# EAGLE design Dclock4 (EAGLE 8.7.0)
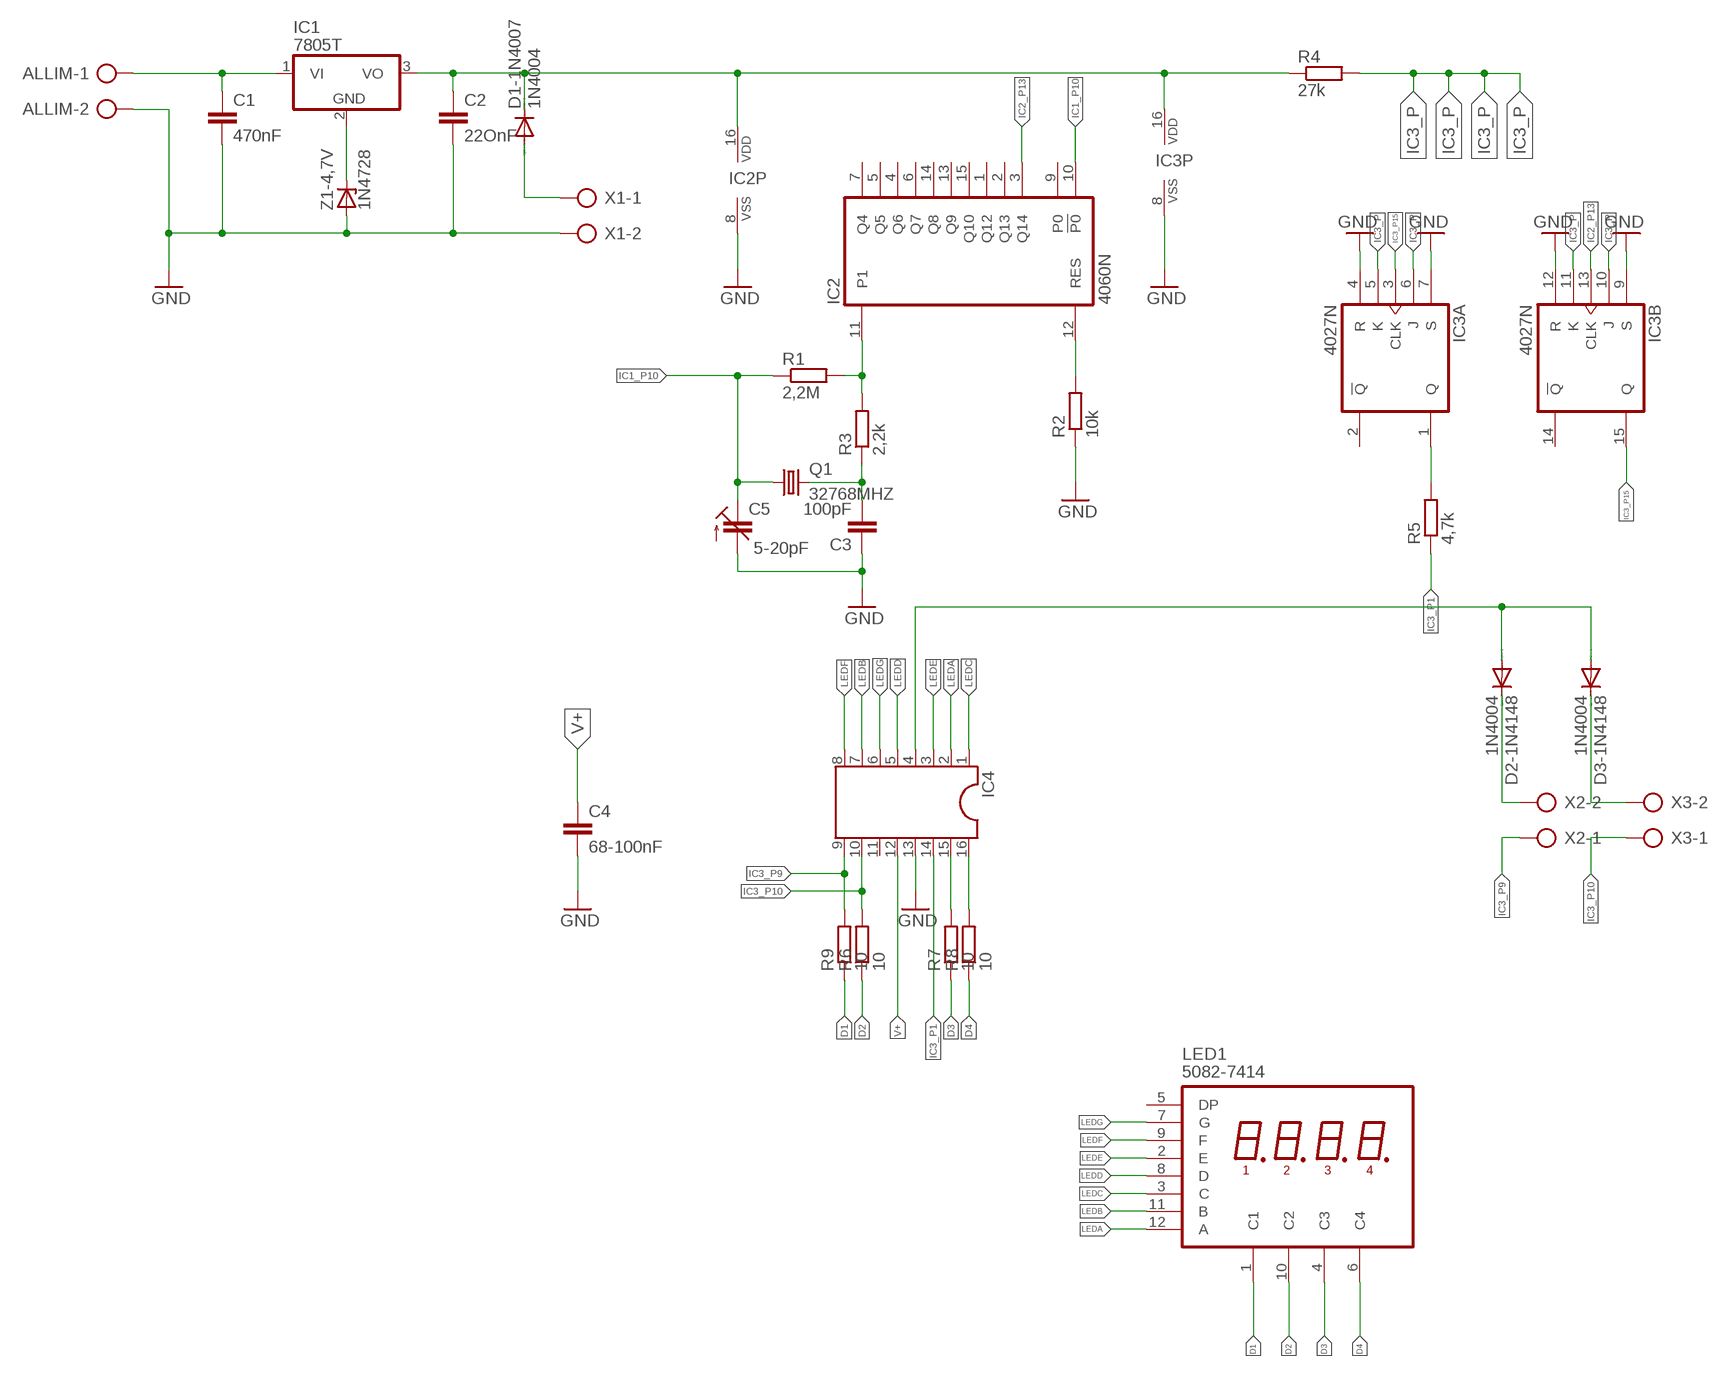
[diagram p0: schematic, sheet 1]

## Parts
ALLIM  AK300/2  [AK300/2]
C1  470nF  C-EU050-050X075  [C050-050X075]
C2  22OnF  C-EU050-050X075  [C050-050X075]
C3  100pF  C-EU050-050X075  [C050-050X075]
C4  68-100nF  C-EU050-050X075  [C050-050X075]
C5  5-20pF  C-TRIMM808-1  [CTRIM808-1]
D1-1N4007  1N4004  [DO41-10]
D2-1N4148  1N4004  [DO41-10]
D3-1N4148  1N4004  [DO41-10]
IC1  7805T  [TO220H]
IC2  4060N  [DIL16]
IC3  4027N  [DIL16]
IC4  DIL16  [DIL16]
LED1  5082-7414  [5082-7414]
Q1  32768MHZ  CRYSTALHC49S  [HC49/S]
R1  2,2M  R-EU_0204/7  [0204/7]
R2  10k  R-EU_0204/7  [0204/7]
R3  2,2k  R-EU_0204/7  [0204/7]
R4  27k  R-EU_0204/7  [0204/7]
R5  4,7k  R-EU_0204/7  [0204/7]
R6  10  R-EU_0204/7  [0204/7]
R7  10  R-EU_0204/7  [0204/7]
R8  10  R-EU_0204/7  [0204/7]
R9  10  R-EU_0204/7  [0204/7]
X1  AK300/2  [AK300/2]
X2  AK300/2  [AK300/2]
X3  AK300/2  [AK300/2]
Z1-4,7V  1N4728  [DO41Z10]

## Nets
D1: LED1.1(C1) R9.1
D2: LED1.10(C2) R6.1
D3: LED1.4(C3) R7.1
D4: LED1.6(C4) R8.1
GND: ALLIM.2 C1.2 C2.2 C3.1 C4.2 C5.2(A) IC2.8(VSS) IC3.4(A:R) IC3.7(A:S) IC3.8(P:VSS) IC3.9(B:S) IC3.12(B:R) IC4.13 R2.1 X1.2 Z1-4,7V.A
IC1_P10: C5.1(E) IC2.10(!P0) Q1.1 R1.1
IC2_P13: IC2.3(Q14) IC3.13(B:CLK)
IC3_P: IC3.5(A:K) IC3.6(A:J) IC3.10(B:J) IC3.11(B:K) R4.2
IC3_P1: IC4.14 R5.1
IC3_P9: IC4.9 R9.2 X2.1
IC3_P10: IC4.10 R6.2 X3.1
IC3_P15: IC3.3(A:CLK) IC3.15(B:Q)
LEDA: IC4.2 LED1.12(A)
LEDB: IC4.7 LED1.11(B)
LEDC: IC4.1 LED1.3(C)
LEDD: IC4.5 LED1.8(D)
LEDE: IC4.3 LED1.2(E)
LEDF: IC4.8 LED1.9(F)
LEDG: IC4.6 LED1.7(G)
N$1: IC3.1(A:Q) R5.2
N$2: D2-1N4148.A D3-1N4148.A IC4.4
N$3: D2-1N4148.C X2.2
N$4: D3-1N4148.C X3.2
N$5: ALLIM.1 C1.1 IC1.1(VI)
N$6: IC1.2(GND) Z1-4,7V.C
N$7: C2.1 D1-1N4007.C IC1.3(VO) IC2.16(VDD) IC3.16(P:VDD) R4.1
N$8: D1-1N4007.A X1.1
N$9: IC4.16 R8.2
N$10: IC4.15 R7.2
N$11: IC2.12(RES) R2.2
N$12: IC2.11(P1) R1.2 R3.2
N$13: C3.2 Q1.2 R3.1
V+: C4.1 IC4.12
Unconnected: IC2.1(Q12) IC2.2(Q13) IC2.4(Q6) IC2.5(Q5) IC2.6(Q7) IC2.7(Q4) IC2.9(P0) IC2.13(Q9) IC2.14(Q8) IC2.15(Q10) IC3.2(A:!Q) IC3.14(B:!Q) IC4.11 LED1.5(DP)

## Library data of the parts
ALLIM X1-X3 = con-ptr500:AK300/2: CONNECTOR; OC_FARNELL: unknown; OC_NEWARK: unknown
C1-C4 = rcl:C-EU: CAPACITOR, European symbol; SPICEPREFIX: C
C5 = rcl:C-TRIMM: Trimm capacitor; SPICEPREFIX: C
D1-1N4007 D2-1N4148 D3-1N4148 = diode:1N4004: DIODE general purpose rectifier, 1 A
IC1 = linear:78*: Positive VOLTAGE REGULATOR Source: http://cache.national.com/ds/LM/LM78L05.pdf http://www.fairchildsemi.com/ds/LM/LM7805.pdf
IC2 = 40xx:4060: 14-stage binary/ripple COUNTER
IC3 = 40xx:4027: Dual JK FLIP FLOP
IC4 = ic-package:DIL16: Dual In Line / Socket
LED1 = hp-displays_4_digits_X_7-segment__DP_LED_display:5082-7414: 4 digits X 7-segment + DP LED display
Q1 = crystal:CRYSTAL: CRYSTAL; OC_FARNELL: 1667008; OC_NEWARK: unknown
R1-R9 = rcl:R-EU_: RESISTOR, European symbol; SPICEPREFIX: R
Z1-4,7V = diode:1N4728: Z DIODE 3.3 V, 1W, 5 percent

## Board
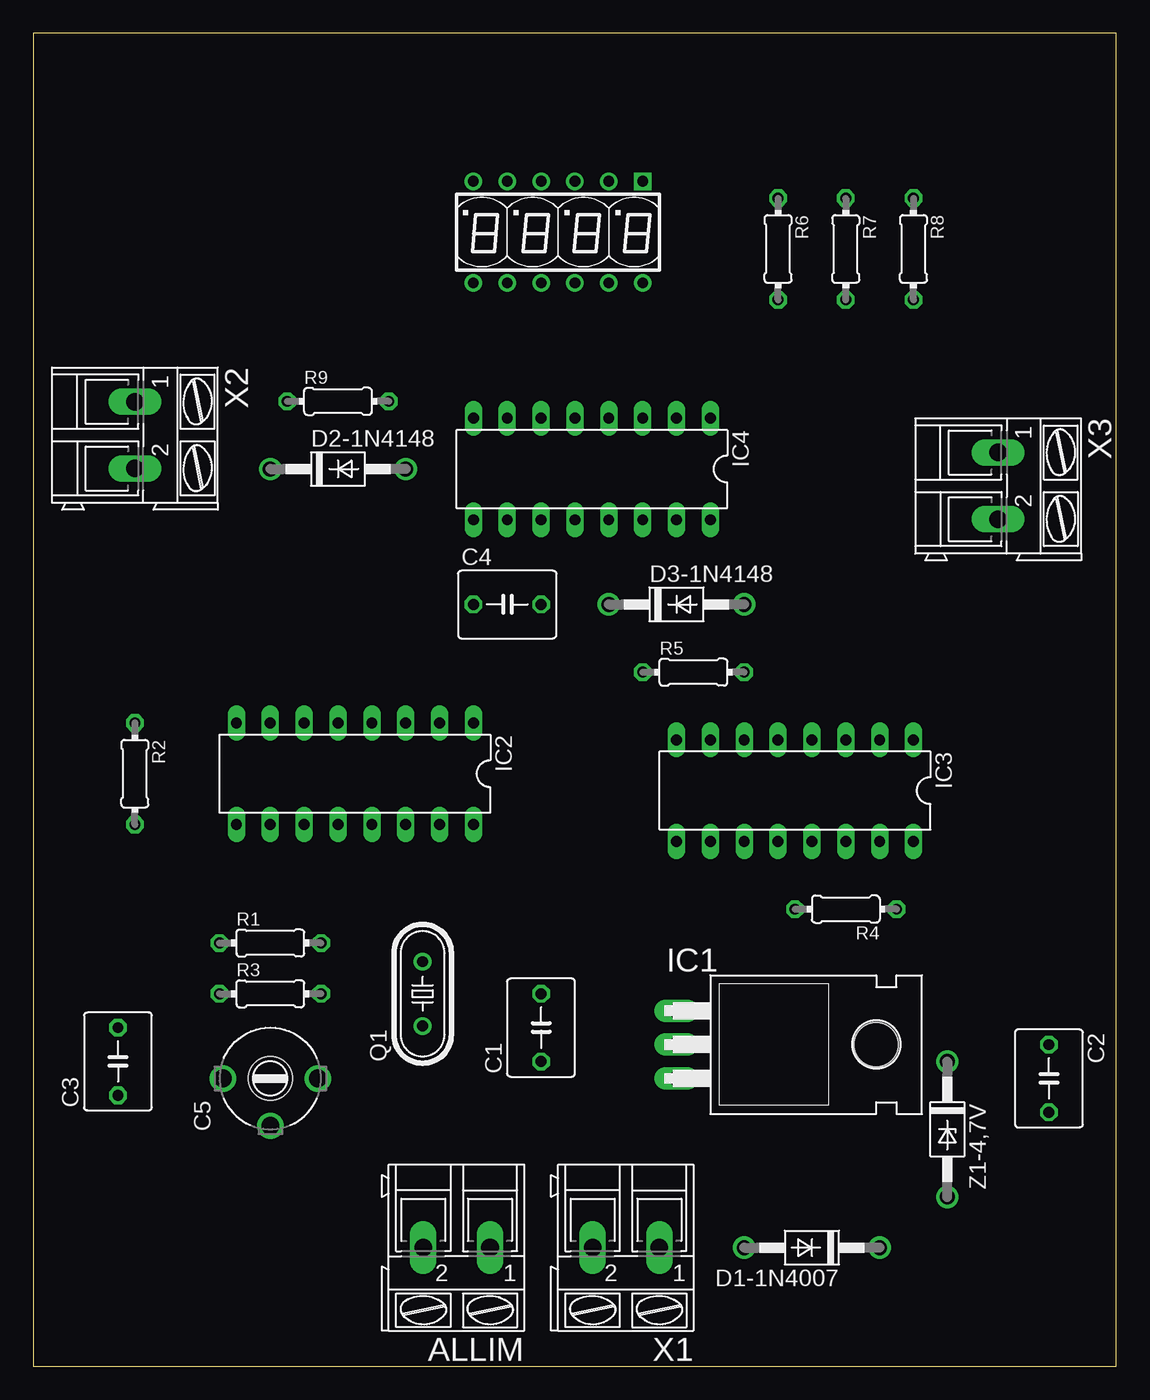
[diagram p1: board, top side]
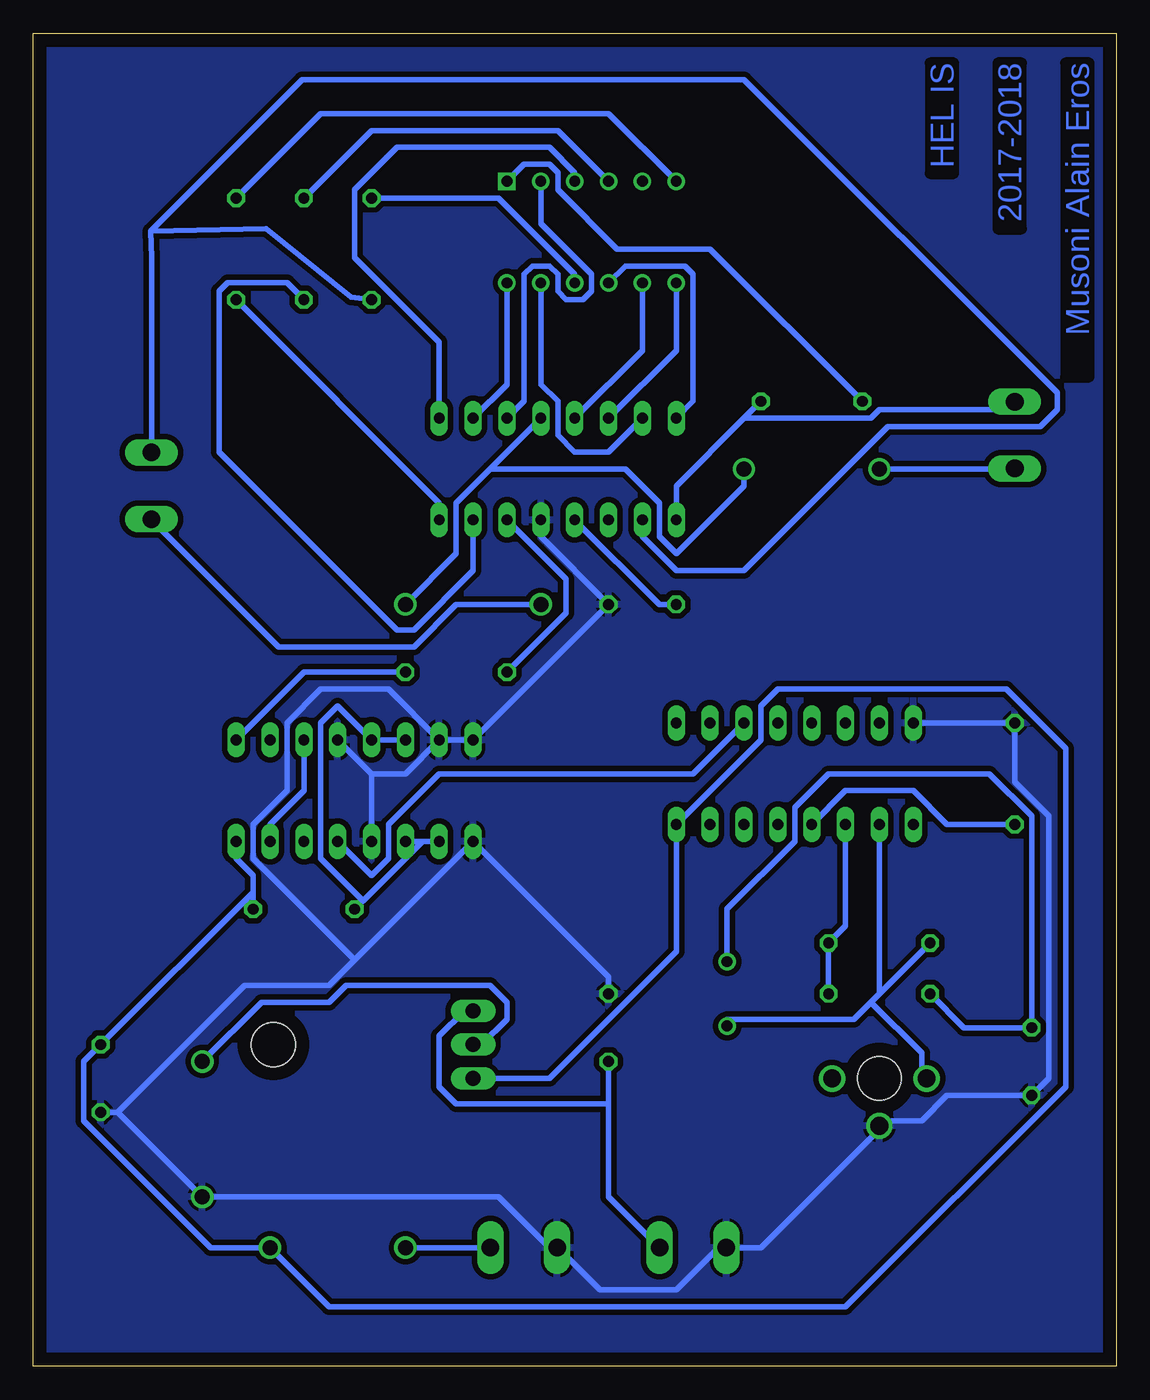
[diagram p2: board, bottom side, seen from below]

Size 81.26 x 100 mm. Coordinates in mm from the lower left corner, seen from the top.
Outline: 0,0 81.26,0 81.26,100 0,100 0,0
Copper layers (1*16): Top 0.035mm / dielectric 1.5mm / Bottom 0.035mm
Design rules "default *": minimum track width 16mil, minimum drill 0.35mm, track to track 16mil, track to pad 16mil, pad to pad 16mil, via to via 16mil, smd to smd 6mil, copper to edge 40mil, drill to drill 6mil, minimum pad ring 10mil, minimum via ring 8mil, stop-mask expansion 4mil, vias tented up to drill 0mil, thermal gap 10mil

### Footprints (pad centres in the part's own frame; a part is rotated, then mirrored left to right if it is on the bottom)
AK300/2 = drill 1.321 long: 1 -2.515,0; 2 2.489,0
C050-050X075 = drill 0.813 octagon: 1 -2.54,0; 2 2.54,0
CTRIM808-1 = drill 1.321: 1 -3.556,0; 2 0,-3.556; 3 3.556,0 | hole 3.302: 0,0
DO41-10 = drill 1.118: A 5.08,0; C -5.08,0
TO220H = drill 1.118 long: 1 -2.54,-10.16; 2 0,-10.16; 3 2.54,-10.16 | hole 3.302: 0,4.826
DIL16 = drill 0.813 long: 1 -8.89,-3.81; 2 -6.35,-3.81; 3 -3.81,-3.81; 4 -1.27,-3.81; 5 1.27,-3.81; 6 3.81,-3.81; 7 6.35,-3.81; 8 8.89,-3.81; 9 8.89,3.81; 10 6.35,3.81; 11 3.81,3.81; 12 1.27,3.81; 13 -1.27,3.81; 14 -3.81,3.81; 15 -6.35,3.81; 16 -8.89,3.81
5082-7414 = drill 0.8 square: 1 0,0 | drill 0.8: 2 2.54,0; 3 5.08,0; 4 7.62,0; 5 10.16,0; 6 12.7,0; 7 12.7,7.62; 8 10.16,7.62; 9 7.62,7.62; 10 5.08,7.62; 11 2.54,7.62; 12 0,7.62
HC49/S = drill 0.813: 1 -2.413,0; 2 2.413,0
0204/7 = drill 0.813 octagon: 1 -3.81,0; 2 3.81,0
DO41Z10 = drill 1.118: A 5.08,0; C -5.08,0

### Placement (x,y rotation side)
ALLIM  31.75,8.89 180 top
C1  38.1,25.4 90 top
C2  76.2,21.59 270 top
C3  6.35,22.86 90 top
C4  35.56,57.15 0 top
C5  17.78,21.59 0 top
D1-1N4007  58.42,8.89 180 top
D2-1N4148  22.86,67.31 0 top
D3-1N4148  48.26,57.15 0 top
IC1  58.42,24.13 270 top
IC2  24.13,44.45 180 top
IC3  57.15,43.18 180 top
IC4  41.91,67.31 180 top
LED1  45.72,88.9 180 top
Q1  29.21,27.94 90 top
R1  17.78,31.75 0 top
R2  7.62,44.45 270 top
R3  17.78,27.94 0 top
R4  60.96,34.29 180 top
R5  49.53,52.07 0 top
R6  55.88,83.82 270 top
R7  60.96,83.82 270 top
R8  66.04,83.82 270 top
R9  22.86,72.39 0 top
X1  44.45,8.89 180 top
X2  7.62,69.85 270 top
X3  72.39,66.04 270 top
Z1-4,7V  68.58,17.78 270 top

### Tracks (layer width: path | path; a pad name or v marks a point on that pad's centre or on a via)
D1
  Bottom 0.406: LED1.1 44.45,90.17 42.55,90.17 41.91,89.53 41.91,88.27 37.47,83.82 30.48,83.82 R9.1
D2
  Bottom 0.406: LED1.10 40.64,81.92 46.35,87.63 R6.1
D3
  Bottom 0.406: LED1.4 41.91,92.71 55.88,92.71 R7.1
D4
  Bottom 0.406: LED1.6 38.1,93.98 59.69,93.98 R8.1
GND
  Bottom 0.406: IC2.8 R2.1 7.62,43.81 5.08,41.27 5.08,21.59 C3.1 12.7,20.32 14.61,18.41 17.78,18.41 C5.2 17.78,17.78 26.67,8.89 ALLIM.2 29.84,8.89 33.02,5.71 38.73,5.71 41.91,8.89 X1.2 42.55,8.89 46.35,12.7 Z1-4,7V.A 74.93,19.05 | 55.88,44.45 IC3.12 | IC3.4 55.88,44.45 | IC3.7 IC3.8 C4.2 43.18,62.23 IC4.13 | 55.88,44.45 53.34,44.45 IC3.7 | C1.2 38.1,29.21 IC3.9 57.15,30.48 | 74.93,19.05 C2.2 | 57.15,30.48 59.05,28.57 65.41,28.57 74.93,19.05 | IC3.7 54.61,50.8 59.69,50.8 62.23,48.26 62.23,43.18 64.77,40.64 64.77,38.1 57.15,30.48
  pour Bottom: 0.41,0.81 0.61,99.36 80.67,99.36 80.67,0.61
IC1_P10
  Bottom 0.406: R1.1 17.78,27.94 | 17.78,27.94 18.41,27.3 | 18.41,27.3 19.68,26.04 29.21,26.04 Q1.1 | 17.78,27.94 IC2.10 | 18.41,27.3 14.61,23.5 14.61,21.59 C5.1
IC2_P13
  Bottom 0.406: IC3.13 55.88,36.83 54.61,38.1 54.61,40.64 50.8,44.45 31.75,44.45 IC2.3
IC3_P
  Bottom 0.406: IC3.6 IC3.5 58.42,49.53 59.69,48.26 59.69,38.1 56.52,34.92 | IC3.11 52.07,39.37 | 52.07,39.37 IC3.10 | 52.07,39.37 56.52,34.92 | 56.52,34.92 R4.2
IC3_P1
  Bottom 0.406: R5.1 41.27,56.52 41.27,59.05 IC4.14
IC3_P9
  Bottom 0.406: IC4.9 33.02,66.04 27.94,71.12 | R9.2 27.94,71.12 | 27.94,71.12 18.41,71.12 17.78,71.75 7.62,71.75 X2.1
IC3_P10
  Bottom 0.406: IC4.10 35.56,62.23 33.02,59.69 27.94,59.69 17.14,70.48 5.71,70.48 4.45,71.75 4.45,73.03 27.94,96.52 61.09,96.52 72.47,85.14 | 72.47,85.14 72.39,83.19 X3.1 | R6.2 57.43,80.21 63.78,85.34 72.47,85.14
IC3_P15
  Bottom 0.406: IC3.15 63.5,40.64 60.96,43.18 IC3.3
LEDA
  Bottom 0.406: LED1.12 45.72,73.66 IC4.2
LEDB
  Bottom 0.406: LED1.11 43.18,73.66 41.91,72.39 41.91,69.85 40.64,68.58 38.1,68.58 IC4.7
LEDC
  Bottom 0.406: LED1.3 40.64,89.53 42.55,91.44 53.98,91.44 57.15,88.27 57.15,83.19 50.8,76.83 IC4.1
LEDD
  Bottom 0.406: LED1.8 35.56,76.2 IC4.5
LEDE
  Bottom 0.406: LED1.2 43.18,85.72 39.37,81.92 39.37,80.64 40.01,80.01 41.27,80.01 41.91,80.64 41.91,81.92 42.55,82.55 43.81,82.55 44.45,81.92 44.45,72.39 IC4.3
LEDF
  Bottom 0.406: LED1.9 36.83,82.55 32.38,82.55 31.75,81.92 31.75,72.39 IC4.8
LEDG
  Bottom 0.406: LED1.7 33.02,76.2 IC4.6
N$1
  Bottom 0.406: R5.2 60.96,52.07 IC3.1
N$2
  Bottom 0.406: 46.99,67.31 49.53,64.77 49.53,60.96 D3-1N4148.A | 46.99,67.31 IC4.4 | D2-1N4148.A 27.94,66.04 33.02,60.96 34.29,62.23 34.29,64.77 36.83,67.31 46.99,67.31
N$3
  Bottom 0.406: D2-1N4148.C 7.62,67.31 X2.2
N$4
  Bottom 0.406: D3-1N4148.C 49.53,57.15 52.7,53.98 62.87,53.98 72.39,63.5 X3.2
N$5
  Bottom 0.406: 38.1,19.68 38.1,12.7 34.29,8.89 ALLIM.1 | 38.1,19.68 C1.1 | IC1.1 48.9,26.67 50.8,24.77 50.8,20.95 49.53,19.68 38.1,19.68
N$6
  Bottom 0.406: IC1.2 47.62,24.13 45.72,26.04 45.72,27.3 46.99,28.57 57.78,28.57 59.05,27.3 64.14,27.3 Z1-4,7V.C
N$7
  Bottom 0.406: IC1.3 42.55,21.59 33.02,31.11 IC2.16 26.67,46.99 26.67,49.53 25.4,50.8 8.26,50.8 3.81,46.35 3.81,20.95 20.32,4.45 59.05,4.45 D1-1N4007.C 67.94,8.89 77.47,18.41 77.47,22.86 C2.1 64.77,35.56 | 64.77,35.56 64.77,36.83 66.04,38.1 IC3.16 | 64.77,35.56 R4.1
N$8
  Bottom 0.406: X1.1 D1-1N4007.A
N$9
  Bottom 0.406: IC4.16 50.8,64.77 R8.2
N$10
  Bottom 0.406: IC4.15 48.26,59.69 52.7,55.24 53.98,55.24 67.31,68.58 67.31,80.64 66.67,81.28 62.23,81.28 R7.2
N$11
  Bottom 0.406: R2.2 12.7,40.64 15.24,43.18 20.32,43.18 IC2.12
N$12
  Bottom 0.406: R3.2 R1.2 20.32,33.02 IC2.11
N$13
  Bottom 0.406: R3.1 11.43,25.4 C3.2 6.35,41.27 9.53,44.45 21.59,44.45 24.13,41.91 24.13,39.37 29.21,34.29 Q1.2
V+
  Bottom 0.406: C4.1 34.29,57.15 IC4.12

### Text on the board
Bottom: Musoni Alain Eros | 2017-2018 | HEL IS